# Altium schematic sheet LVMCU.SchDoc
size A4; SheetNumber: 2; SheetTotal: 3
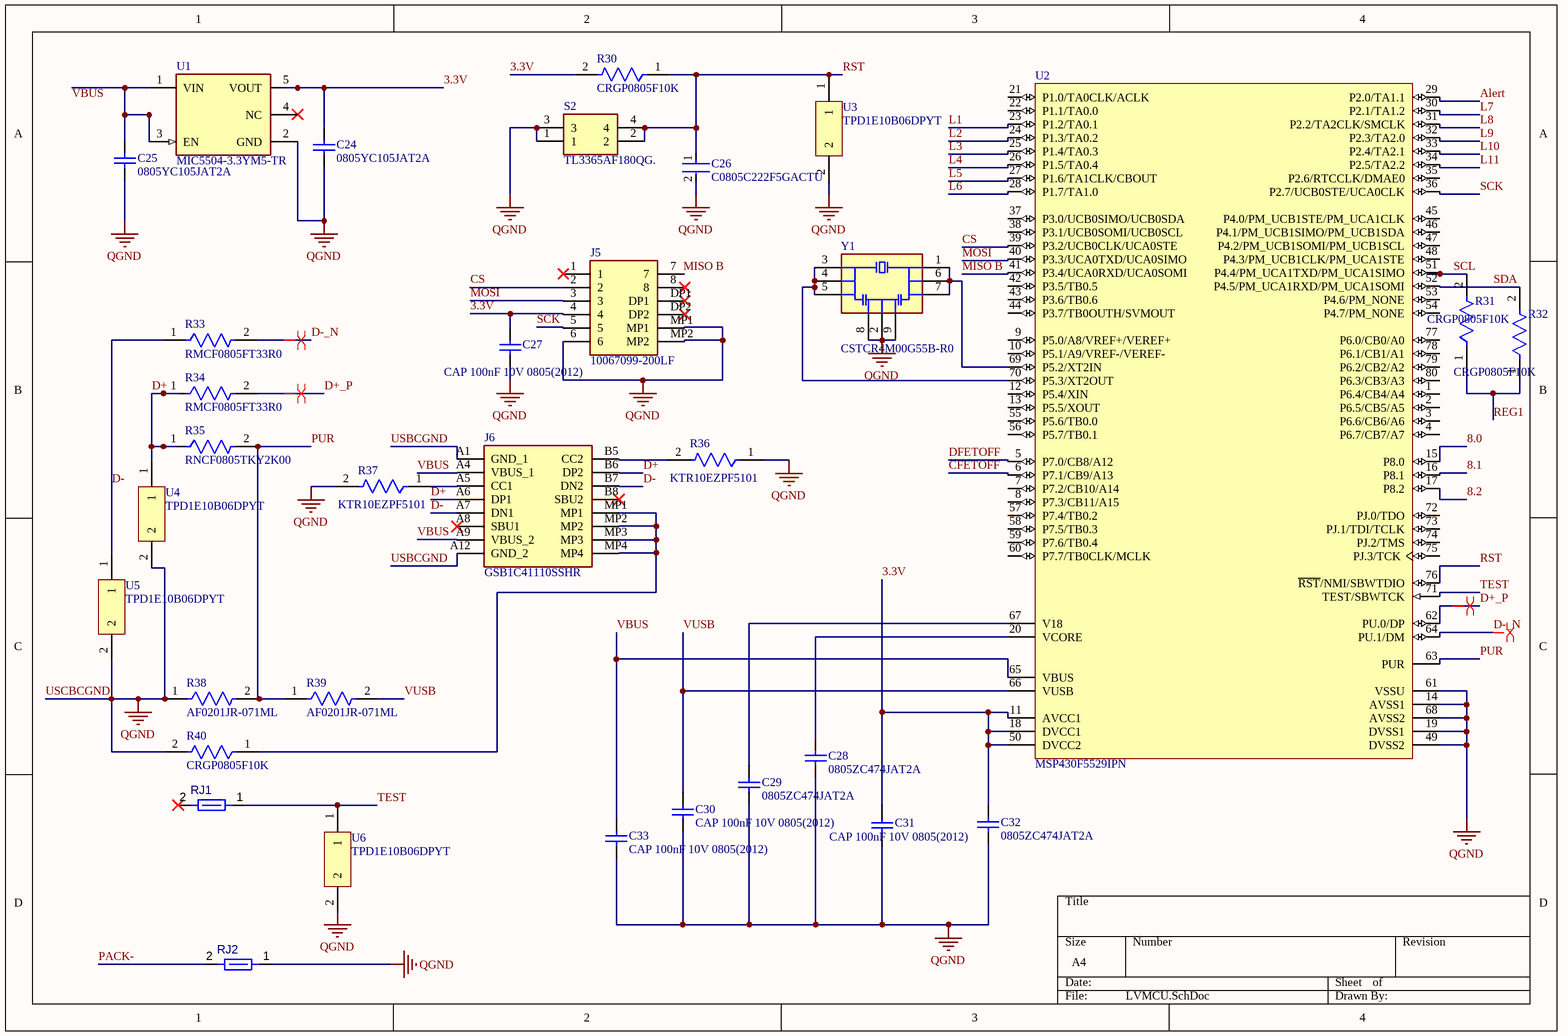
[diagram p0: LVMCU.SchDoc]

## Parts
C24  0805YC105JAT2A  [CAPC2013X140X50ML20T25]
C25  0805YC105JAT2A  [CAPC2013X140X50ML20T25]
C26  C0805C222F5GACTU  [FP-C0805C-DN-MFG]
C27  CAP 100nF 10V 0805(2012)  [CAPC0805(2012)100_M]
C28  0805ZC474JAT2A  [CAPC2013X140X50LL20T25]
C29  0805ZC474JAT2A  [CAPC2013X140X50LL20T25]
C30  CAP 100nF 10V 0805(2012)  [CAPC0805(2012)100_M]
C31  CAP 100nF 10V 0805(2012)  [CAPC0805(2012)100_M]
C32  0805ZC474JAT2A  [CAPC2013X140X50LL20T25]
C33  CAP 100nF 10V 0805(2012)  [CAPC0805(2012)100_M]
J5  10067099-200LF  [10067099200LF]
J6  GSB1C41110SSHR  [GSB1C41110SSHR]
R30  CRGP0805F10K  [FP-CRGP0805-IPC_C]
R31  CRGP0805F10K  [FP-CRGP0805-IPC_C]
R32  CRGP0805F10K  [FP-CRGP0805-IPC_C]
R33  RMCF0805FT33R0  [FP-RMCF0805-MFG]
R34  RMCF0805FT33R0  [FP-RMCF0805-MFG]
R35  RNCF0805TKY2K00  [FP-RNCF0805-MFG]
R36  KTR10EZPF5101  [FP-KTR10-MFG]
R37  KTR10EZPF5101  [FP-KTR10-MFG]
R38  AF0201JR-071ML  [FP-AF0201-IPC_B]
R39  AF0201JR-071ML  [FP-AF0201-IPC_B]
R40  CRGP0805F10K  [FP-CRGP0805-IPC_C]
RJ1  Net Tie 0.6x1.4mm  [SHORT10_8MIL-FP]  (value not drawn)  (net tie, no BOM)
RJ2  Net Tie 0.6x1.4mm  [SHORT10_8MIL-FP]  (value not drawn)  (net tie, no BOM)
S2  TL3365AF180QG.  [TL3365AF180QG]
U1  MIC5504-3.3YM5-TR  [FP-SOT23-5LD-PL-1-MFG]
U2  MSP430F5529IPN  [PN0080A_L]
U3  TPD1E10B06DPYT  [DPY0002A_L]
U4  TPD1E10B06DPYT  [DPY0002A_L]
U5  TPD1E10B06DPYT  [DPY0002A_L]
U6  TPD1E10B06DPYT  [DPY0002A_L]
Y1  CSTCR4M00G55B-R0  [CSTCR4M00G55B95R0]

## Nets
USCBCGND: C24.1 C25.1 C26.2 C27.1 C28.1 C29.1 C30.1 C31.1 C32.1 C33.1 J5.6 J5.MP1 J5.MP2 R36.1 R37.2 R38.1 R40.2 RJ2.1 S2.1 S2.3 U1.2(GND) U2.14(AVSS1) U2.19(DVSS1) U2.49(DVSS2) U2.61(VSSU) U2.68(AVSS2) U3.2 U4.2 U5.2 U6.2 Y1.2(GND_1) Y1.8(GND_3) Y1.9(OUTPUT_3)  [also labelled QGND]
3.3V: C24.2 C27.2 C31.2 C32.2 J5.4 R30.2 U1.5(VOUT) U2.11(AVCC1) U2.18(DVCC1) U2.50(DVCC2)
8.0: U2.15(P8.0)
8.1: U2.16(P8.1)
8.2: U2.17(P8.2)
Alert: U2.29(P2.0/TA1.1)
CFETOFF: U2.6(P7.1/CB9/A13)
CS: J5.2 U2.39(P3.2/UCB0CLK/UCA0STE)
D+: J6.A6(DP1) J6.B6(DP2) R34.1 R35.1 U4.1
D+_P: R34.2 U2.62(PU.0/DP)
D-: J6.A7(DN1) J6.B7(DN2) R33.1 U5.1
D-_N: R33.2 U2.64(PU.1/DM)
DFETOFF: U2.5(P7.0/CB8/A12)
L1: U2.23(P1.2/TA0.1)
L2: U2.24(P1.3/TA0.2)
L3: U2.25(P1.4/TA0.3)
L4: U2.26(P1.5/TA0.4)
L5: U2.27(P1.6/TA1CLK/CBOUT)
L6: U2.28(P1.7/TA1.0)
L7: U2.30(P2.1/TA1.2)
L8: U2.31(P2.2/TA2CLK/SMCLK)
L9: U2.32(P2.3/TA2.0)
L10: U2.33(P2.4/TA2.1)
L11: U2.34(P2.5/TA2.2)
MISO B: J5.7 U2.41(P3.4/UCA0RXD/UCA0SOMI)
MOSI: J5.3 U2.40(P3.3/UCA0TXD/UCA0SIMO)
PACK-: RJ2.2
PUR: R35.2 R38.2 R39.1 U2.63(PUR)
REG1: R31.1 R32.1
RST: C26.1 R30.1 S2.2 S2.4 U2.76(~{RST}/NMI/SBWTDIO) U3.1
SCK: J5.5 U2.36(P2.7/UCB0STE/UCA0CLK)
SCL: R31.2 U2.51(P4.4/PM_UCA1TXD/PM_UCA1SIMO)
SDA: R32.2 U2.52(P4.5/PM_UCA1RXD/PM_UCA1SOMI)
TEST: RJ1.1 U2.71(TEST/SBWTCK) U6.1
USBCGND: J6.A1(GND_1) J6.A12(GND_2)
VBUS: C33.2 J6.A4(VBUS_1) J6.A9(VBUS_2) U2.65(VBUS)
VUSB: C30.2 R39.2 U2.66(VUSB)
NetC25_2: C25.2 U1.1(VIN) U1.3(EN)
NetC28_2: C28.2 U2.20(VCORE)
NetC29_2: C29.2 U2.67(V18)
NetJ6_A5: J6.A5(CC1) R37.1
NetJ6_B5: J6.B5(CC2) R36.2
NetJ6_MP1: J6.MP1 J6.MP2 J6.MP3 J6.MP4 R40.1
NetU2_69: U2.69(P5.2/XT2IN) Y1.1(INPUT_1) Y1.6(OUTPUT_2) Y1.7(INPUT_3)
NetU2_70: U2.70(P5.3/XT2OUT) Y1.3(OUTPUT_1) Y1.4(INPUT_2) Y1.5(GND_2)

Not connected (* = marked no-connect by the designer): J5 1* 8* DP1* DP2*; J6 A8(SBU1)* B8(SBU2)*; RJ1 2*; U1 4(NC)*; U2 1(P6.4/CB4/A4) 2(P6.5/CB5/A5) 3(P6.6/CB6/A6) 4(P6.7/CB7/A7) 7(P7.2/CB10/A14) 8(P7.3/CB11/A15) 9(P5.0/A8/VREF+/VEREF+) 10(P5.1/A9/VREF-/VEREF-) 12(P5.4/XIN) 13(P5.5/XOUT) 21(P1.0/TA0CLK/ACLK) 22(P1.1/TA0.0) 35(P2.6/RTCCLK/DMAE0) 37(P3.0/UCB0SIMO/UCB0SDA) 38(P3.1/UCB0SOMI/UCB0SCL) 42(P3.5/TB0.5) 43(P3.6/TB0.6) 44(P3.7/TB0OUTH/SVMOUT) 45(P4.0/PM_UCB1STE/PM_UCA1CLK) 46(P4.1/PM_UCB1SIMO/PM_UCB1SDA) 47(P4.2/PM_UCB1SOMI/PM_UCB1SCL) 48(P4.3/PM_UCB1CLK/PM_UCA1STE) 53(P4.6/PM_NONE) 54(P4.7/PM_NONE) 55(P5.6/TB0.0) 56(P5.7/TB0.1) 57(P7.4/TB0.2) 58(P7.5/TB0.3) 59(P7.6/TB0.4) 60(P7.7/TB0CLK/MCLK) 72(PJ.0/TDO) 73(PJ.1/TDI/TCLK) 74(PJ.2/TMS) 75(PJ.3/TCK) 77(P6.0/CB0/A0) 78(P6.1/CB1/A1) 79(P6.2/CB2/A2) 80(P6.3/CB3/A3)

## Layout directives
differential pair: D+_P, D-_N

## Notes on the sheet
- Labels drawn without touching a wire or pin: VBUS

## Library data of the parts
C24 C25 = CMP-1036-04744-2: Manufacturer: AVX Interconnect / Elco; Part Number: 0805YC105JAT2A
C26 = CMP-03020-028856-1: CAP CER 2200PF 50V C0G/NP0 0805; Temperature Coefficient: 30ppm/°C; Value: 2,200 pF; Material: Ceramic; Temperature Characteristic: C0G; Tolerance: 0.01; Description: C0805 2,200 pF C0G 30ppm/°C 1.00% 50 V; Automotive: No; Octopart: https://octopart.com/c0805c222f5gactu-kemet-17301038; ComponentLink2Description: Datasheet; Height: 0.88mm; RoHS: TRUE; Category: Cap; Device Class L1: Passive Components; Temperature Range High: +125°C; Ipc Land Pattern Name: CAPC200125X78; Lead Free: Yes; Temperature: -55°C to +125°C; Device Class L3: Ceramic Capacitors; Voltage Rating: 50 V; Capacitance: 2,200 pF; Package: C0805C-DN; Device Class L2: Capacitors; ComponentLink2URL: https://content.kemet.com/datasheets/KEM_C1003_C0G_SMD.pdf; Mouser Description: Multilayer Ceramic Capacitors MLCC - SMD/SMT 50V 0.0022uF 1% C0G; Digikey Description: CAP CER 2200PF 50V C0G/NP0 0805; Temperature Range Low: -55°C
C27 C30 C31 C33 = CMP-1036-04393-1: CAP 100nF 10V ±5% 0805 (2012 Metric) Thickness 1mm SMD; Tolerance: Â±5%; Case-EIA: 0805; Case-Metric: 2012; Rated Voltage: 10 V; Technology: SMT; Value: 100nF; Max Thickness: 1 mm
C28 C29 C32 = CMP-2007-04675-1
J5 = 10067099-200LF: Connector; Datasheet Link: https://cdn.amphenol-cs.com/media/wysiwyg/files/drawing/10067099.pdf; Height: 2.8mm; Manufacturer_Part_Number: 10067099-200LF; Mouser Part Number: 649-10067099-200LF; Mouser Price/Stock: https://www.mouser.co.uk/ProductDetail/Amphenol-FCI/10067099-200LF?qs=i4V1y6YhAeneA%2F%2FxXHdZ7w%3D%3D; Arrow Part Number: 10067099-200LF; Arrow Price/Stock: https://www.arrow.com/en/products/10067099-200lf/amphenol-fci?utm_currency=USD&region=nac
J6 = GSB1C41110SSHR: Connector; Manufacturer_Name: Amphenol Communications Solutions; Datasheet Link: https://cdn.amphenol-cs.com/media/wysiwyg/files/drawing/gsb1c41x10sshr-ax1.pdf; Height: 3.41mm; Manufacturer_Part_Number: GSB1C41110SSHR
R30-R32 R40 = CMP-03211-006861-1: CRGP 0805 10K 1%; Power Rating: 0.33W; Description: CRGP0805 10KΩ 0.33W ±100ppm/°C 1% 150V; Voltage Rating: 150V; Value: 10KΩ; Tolerance: 0.01; Temperature Coefficient: ±100ppm/°C; ComponentLink2URL: https://www.mouser.com/datasheet/2/418/NG_DS_9-1773463-9_A-1358566.pdf; Temperature Range Low: -55°C; Ipc Land Pattern Name: RESC200125X55; Device Class L2: Resistors; Automotive: No; Device Class L3: Chip SMD Resistors; Composition: Thick Film; Temperature Range High: +155°C; Temperature: -55°C to +155°C; Height: 0.65mm; Series: CRGP; RoHS: TRUE; Device Class L1: Passive Components; Octopart: https://octopart.com/crgp0805f10k-te+connectivity-91018782; Package: CRGP0805; Digikey Description: CRGP 0805 10K 1%; Ambient Temperature Range High: +70°C; Lead Free: Yes; ComponentLink2Description: Datasheet; Category: Res; Resistance: 10KΩ
R33 R34 = CMP-26527-003272-1: 33Ω ±1% 0.125W 0805 Thick Film Chip Resistor AEC-Q200 compliant; Resistance: 33R; Max Power Dissipation: 125mW; Temperature Coefficient: 100ppm/°C; Height: 0.026inch; Contact Plating: Tin; Features: Automotive AEC-Q200; RoHS Compliant: Yes; Number of Terminations: 2; Min Operating Temperature: -55°C; Length: 0.079inch; Case/Package: 0805; Case Code (Metric): 2012; Series: RMCF; Width: 0.049inch; Mount: Surface Mount; Radiation Hardening: No; Case Code (Imperial): 0805; Tolerance: 1%; Packaging: Tape and Reel; Max Operating Temperature: 155°C; Resistor Type: Thick Film
R35 = CMP-26527-000024-1: RES 2K OHM 0.01% 1/8W 0805; Max Power Dissipation: 125mW; Resistance: 2kR; Temperature Coefficient: 5ppm/°C; Case Code (Imperial): 0805; Case/Package: 0805; Max Operating Temperature: 155°C; Tolerance: 0.01%; Length: 0.079inch; Case Code (Metric): 2012; Composition: Thin Film; Mount: Surface Mount; Width: 0.049inch; Min Operating Temperature: -55°C; Packaging: Tape and Reel; Number of Terminations: 2; Features: Moisture Resistant; Height: 0.026inch
R36 R37 = CMP-08839-031572-1: Res Thick Film 0805 5.1kΩ 1% 0.125W ±100ppm/°C Automotive Paper T/R; Max Power Dissipation: 125mW; Resistance: 5.1kR; Number of Terminations: 2; Features: Automotive AEC-Q200; Height: 0.026inch; Length: 0.079inch; Case/Package: 0805; Packaging: Tape and Reel; Case Code (Imperial): 0805; Min Operating Temperature: -55°C; Tolerance: 1%; Width: 0.049inch; Max Operating Temperature: 155°C; Resistor Type: Thick Film; Temperature Coefficient: 100ppm/°C; Series: KTR; Package Quantity: 5000; Case Code (Metric): 2012; RoHS Compliant: Yes
R38 R39 = CMP-03412-038487-1: Anti-Sulfurated Chip Resistors Automotive Grade 1MΩ 5% 200ppm/°C 0201; Resistance: 1MR; Max Power Dissipation: 50mW; Height: 0.01inch; Width: 0.012inch; Max Operating Temperature: 125°C; Case/Package: 0201; Resistor Type: Thick Film; Temperature Coefficient: 200ppm/°C; Packaging: Tape and Reel; RoHS Compliant: Yes; Number of Terminations: 2; Series: AF; Tolerance: 5%; Features: Moisture Resistant; Length: 0.024inch; Min Operating Temperature: -55°C
RJ1 RJ2 = CMP-009-00120-2: Max Operating Temperature: 155°C; Min Operating Temperature: -55°C; Pins: 2
S2 = TL3365AF180QG.: Switch; Datasheet Link: https://sten-eswitch-13110800-production.s3.amazonaws.com/system/asset/product_line/data_sheet/218/TL3365.pdf; Height: 2.5mm; Manufacturer_Part_Number: TL3365AF180QG.
U1 = CMP-2000-07604-2: IC REG LINEAR 3.3V 300MA SOT23-5; Quiescent Current: 38uA; Operating Supply Current: 42uA; Max Input Voltage: 5.5V; Min Input Voltage: 2.5V; Output Type: Fixed; Power Supply Rejection Ratio (PSRR): 60dB; Dropout Voltage: 380mV; Accuracy: 3%; Number of Outputs: 1; Nominal Output Voltage: 3.3V; Max Output Current: 300mA; Length: 2.9mm; Mount: Surface Mount; Width: 1.6mm; Packaging: Tape and Reel; Output Current: 300mA; Min Operating Temperature: -40°C; Max Operating Temperature: 125°C; Height: 1.1mm; Case/Package: SOT-23-5; REACH SVHC: No SVHC; Number of Pins: 5; Output Voltage: 3.3V
U2 = CMP-0365-00412-2: 25 MHz Mixed Signal Microcontroller with 128 KB Flash, 8192 B SRAM and 63 GPIOs, -40 to 85 degC, 80-pin QFP (PN), Green (RoHS & no Sb/Br); USCI_B (I2C & SPI): 2; Comparators: Yes; SubFamily: 5 Series; Flash(KB): 128; ADC: 12-bit SAR; DMA: 3; SRAM(B): 8192; ADC Channels: 16; GPIO: 63; Timers - 16-bit: 4; Multiplier: 32x32; USB: 1; Frequency(MHz): 25; PackageDescription: 80-Pin Plastic Quad Flat Pack, Body 12 x 12 mm, Pitch 0.5 mm; ComponentLink3Description: Package Specification; PackageReference: PN0080A; Brown Out Reset: Yes; Mounting Technology: Surface Mount; ComponentLink3URL: http://www.ti.com/lit/ml/mtqf010a/mtqf010a.pdf; ComponentLink2Description: Datasheet; Real-Time Clock: Yes; ComponentLink1Description: Manufacturer URL; PartNumber: MSP430F5529IPN; Temp Sensor: Yes; USCI_A (UART/LIN/IrDA/SPI): 2; Code_JEDEC: MS-018; Watchdog: Yes; Eco-Plan: Green (RoHS & no Sb/Br); ComponentLink2URL: http://www.ti.com/general/docs/lit/getliterature.tsp?genericPartNumber=MSP430F5529&fileType=pdf; SVS: Yes; ComponentLink1URL: http://www.ti.com/; DatasheetVersion: SLAS590I
U3-U6 = CMP-0326-00006-3: ESD Protection in 0402 Package with 10 pF Capacitance and 6 V Breakdown, 1 Channel, -40 to +125 degC, 2-pin X2SON (DPY); IEC 61000-4-2 Air-Gap(+/- kV): 30; SubFamily: ESD Solution; Eco-Plan: TBD; IO Capacitance(Typ)(pF): 10; Breakdown Voltage(Min)(V): 6; ComponentLink2Description: Datasheet; ComponentLink3URL: SamplesURL:http://www.ti.com/product/tpd1e10b06#samples; PartNumber: TPD1E10B06DPYT; ComponentLink2URL: http://www.ti.com/general/docs/lit/getliterature.tsp?genericPartNumber=TPD1E10B06&fileType=pdf; PackageVersion: revA, Apr-2010; ComponentLink1URL: http://www.ti.com/; ComponentLink3Description: URL Link1; IO Leakage Current(nA): 10; DatasheetVersion: SLLSEB1; ComponentLink1Description: Manufacturer URL; PackageDescription: 2-Pin Plastic Small Outline No-Lead 1.0 x 0.6 x 0.4 mm Body; PackageReference: DPY0002A; IEC 61000-4-2 Contact(+/- kV): 30; Mounting Technology: Surface Mount
Y1 = CSTCR4M00G55B-R0: Crystal or Oscillator; Datasheet Link: https://www.murata.com/products/productdata/8801043513374/SPEC-CSTCR4M00G55B-R0.pdf; Manufacturer_Part_Number: CSTCR4M00G55B-R0; Mouser Part Number: 81-CSTCR4M00G55B-R0; Mouser Price/Stock: https://www.mouser.co.uk/ProductDetail/Murata-Electronics/CSTCR4M00G55B-R0?qs=fPfMK8GXCEJpvxE6N93dow%3D%3D; Arrow Part Number: CSTCR4M00G55B-R0; Arrow Price/Stock: https://www.arrow.com/en/products/cstcr4m00g55b-r0/murata-manufacturing?utm_currency=USD&region=nac